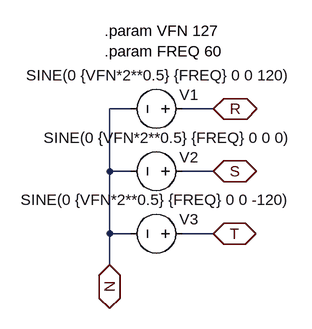
[diagram p0: schematic voltage3.asc]
voltage3.asc, the LTspice schematic file:
Version 4
SHEET 1 880 680
WIRE 144 128 112 128
WIRE 272 128 224 128
WIRE 112 224 112 128
WIRE 144 224 112 224
WIRE 272 224 224 224
WIRE 112 320 112 224
WIRE 144 320 112 320
WIRE 272 320 224 320
WIRE 112 368 112 320
FLAG 112 368 N
IOPIN 112 368 BiDir
FLAG 272 128 R
IOPIN 272 128 BiDir
FLAG 272 224 S
IOPIN 272 224 BiDir
FLAG 272 320 T
IOPIN 272 320 BiDir
SYMBOL voltage 240 128 R90
WINDOW 0 -22 -9 VRight 2
WINDOW 3 -52 -152 VRight 2
WINDOW 123 0 0 Left 0
WINDOW 39 0 0 Left 0
SYMATTR InstName V1
SYMATTR Value SINE(0 {VFN*2**0.5} {FREQ} 0 0 120)
SYMBOL voltage 240 224 R90
WINDOW 0 -22 -9 VRight 2
WINDOW 3 -52 -152 VRight 2
WINDOW 123 0 0 Left 0
WINDOW 39 0 0 Left 0
SYMATTR InstName V2
SYMATTR Value SINE(0 {VFN*2**0.5} {FREQ} 0 0 0)
SYMBOL voltage 240 320 R90
WINDOW 0 -22 -9 VRight 2
WINDOW 3 -52 -152 VRight 2
WINDOW 123 0 0 Left 0
WINDOW 39 0 0 Left 0
SYMATTR InstName V3
SYMATTR Value SINE(0 {VFN*2**0.5} {FREQ} 0 0 -120)
TEXT 104 8 Left 2 !.param VFN 127\n.param FREQ 60

The netlist it stands for:
* voltage3.asc
V1 R N SINE(0 {VFN*2**0.5} {FREQ} 0 0 120)
V2 S N SINE(0 {VFN*2**0.5} {FREQ} 0 0 0)
V3 T N SINE(0 {VFN*2**0.5} {FREQ} 0 0 -120)
.param VFN 127
.param FREQ 60
.backanno
.end